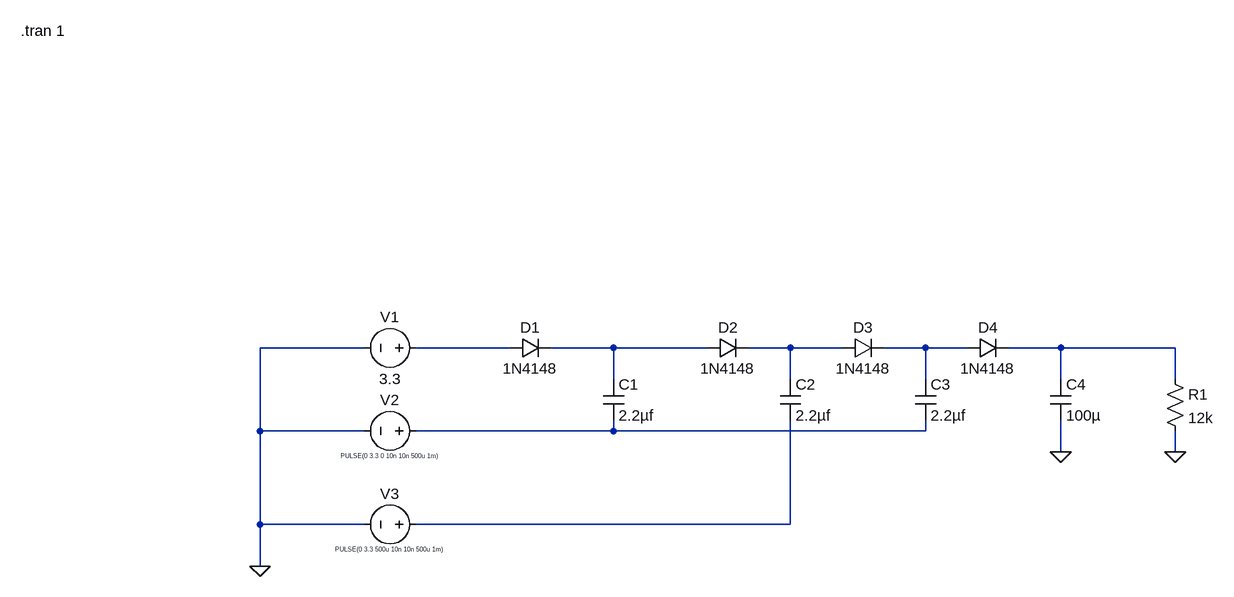
[diagram p0: schematic dickson_v1.asc]
dickson_v1.asc, the LTspice schematic file:
Version 4
SHEET 1 1252 680
WIRE -64 128 -224 128
WIRE 160 128 16 128
WIRE 320 128 224 128
WIRE 464 128 320 128
WIRE 592 128 528 128
WIRE 672 128 592 128
WIRE 800 128 736 128
WIRE 864 128 800 128
WIRE 1008 128 928 128
WIRE 1184 128 1008 128
WIRE 320 176 320 128
WIRE 592 176 592 128
WIRE 800 176 800 128
WIRE 1008 176 1008 128
WIRE 1184 176 1184 128
WIRE -224 256 -224 128
WIRE -64 256 -224 256
WIRE 320 256 320 240
WIRE 320 256 16 256
WIRE 800 256 800 240
WIRE 800 256 320 256
WIRE 1008 288 1008 240
WIRE 1184 288 1184 256
WIRE -224 400 -224 256
WIRE -64 400 -224 400
WIRE 592 400 592 240
WIRE 592 400 16 400
WIRE -224 464 -224 400
FLAG -224 464 0
FLAG 1008 288 0
FLAG 1184 288 0
SYMBOL voltage 32 128 R90
WINDOW 0 -32 56 VBottom 2
WINDOW 3 32 56 VTop 2
WINDOW 123 0 0 Left 0
WINDOW 39 0 0 Left 0
SYMATTR InstName V1
SYMATTR Value 3.3
SYMBOL voltage 32 256 R90
WINDOW 0 -32 56 VBottom 2
WINDOW 3 32 56 VTop 0
WINDOW 123 0 0 Left 0
WINDOW 39 0 0 Left 0
SYMATTR InstName V2
SYMATTR Value PULSE(0 3.3 0 10n 10n 500u 1m)
SYMBOL voltage 32 400 R90
WINDOW 0 -32 56 VBottom 2
WINDOW 3 32 56 VTop 0
WINDOW 123 0 0 Left 0
WINDOW 39 0 0 Left 0
SYMATTR InstName V3
SYMATTR Value PULSE(0 3.3 500u 10n 10n 500u 1m)
SYMBOL diode 160 144 R270
WINDOW 0 32 32 VTop 2
WINDOW 3 0 32 VBottom 2
SYMATTR InstName D1
SYMATTR Value 1N4148
SYMBOL cap 304 176 R0
SYMATTR InstName C1
SYMATTR Value 2.2µf
SYMBOL diode 464 144 R270
WINDOW 0 32 32 VTop 2
WINDOW 3 0 32 VBottom 2
SYMATTR InstName D2
SYMATTR Value 1N4148
SYMBOL diode 672 144 R270
WINDOW 0 32 32 VTop 2
WINDOW 3 0 32 VBottom 2
SYMATTR InstName D3
SYMATTR Value 1N4148
SYMBOL diode 864 144 R270
WINDOW 0 32 32 VTop 2
WINDOW 3 0 32 VBottom 2
SYMATTR InstName D4
SYMATTR Value 1N4148
SYMBOL cap 576 176 R0
SYMATTR InstName C2
SYMATTR Value 2.2µf
SYMBOL cap 784 176 R0
SYMATTR InstName C3
SYMATTR Value 2.2µf
SYMBOL cap 992 176 R0
SYMATTR InstName C4
SYMATTR Value 100µ
SYMBOL res 1168 160 R0
SYMATTR InstName R1
SYMATTR Value 12k
TEXT -592 -360 Left 2 !.tran 1

The netlist it stands for:
* dickson_v1.asc
V1 N001 0 3.3
V2 N006 0 PULSE(0 3.3 0 10n 10n 500u 1m)
V3 N007 0 PULSE(0 3.3 500u 10n 10n 500u 1m)
D1 N001 N002 1N4148
C1 N002 N006 2.2µf
D2 N002 N003 1N4148
D3 N003 N004 1N4148
D4 N004 N005 1N4148
C2 N003 N007 2.2µf
C3 N004 N006 2.2µf
C4 N005 0 100µ
R1 N005 0 12k
.model D D
.lib standard.dio
.tran 1
.backanno
.end